# Altium schematic sheet lan_board.SchDoc
size A4
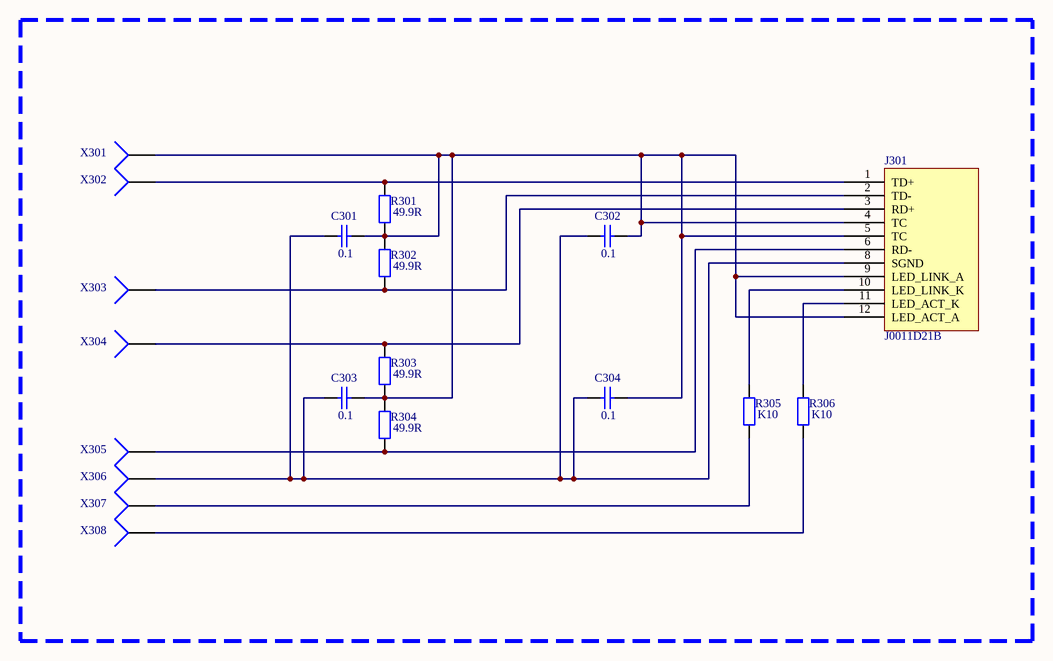
[diagram p0: lan_board.SchDoc]

## Parts
C301  0.1  [C3216-1206]
C302  0.1  [C3216-1206]
C303  0.1  [C3216-1206]
C304  0.1  [C3216-1206]
J301  J0011D21B  [J0011D21B]
R301  49.9R  [_1206]
R302  49.9R  [_1206]
R303  49.9R  [_1206]
R304  49.9R  [_1206]
R305  K10  [_1206]
R306  K10  [_1206]
X301  (no value)  [PIN1]
X302  (no value)  [PIN1]
X303  (no value)  [PIN1]
X304  (no value)  [PIN1]
X305  (no value)  [PIN1]
X306  (no value)  [PIN1]
X307  (no value)  [PIN1]
X308  (no value)  [PIN1]

## Nets
NetC301_1: C301.1 C302.1 C303.1 C304.1 J301.8(SGND) X306.1
NetC301_2: C301.2 C302.2 C303.2 C304.2 J301.4(TC) J301.5(TC) J301.9(LED_LINK_A) J301.12(LED_ACT_A) R301.2 R302.1 R303.2 R304.1 X301.1
NetJ301_1: J301.1(TD+) R301.1 X302.1
NetJ301_2: J301.2(TD-) R302.2 X303.1
NetJ301_3: J301.3(RD+) R303.1 X304.1
NetJ301_6: J301.6(RD-) R304.2 X305.1
NetJ301_10: J301.10(LED_LINK_K) R305.1
NetJ301_11: J301.11(LED_ACT_K) R306.1
NetR305_2: R305.2 X307.1
NetR306_2: R306.2 X308.1

## Library data of the parts
C301-C304 = Cap Semi: Capacitor (Semiconductor SIM Model); Manufacturer: Generic Components; Class I: Passive; Value: 1,0; Published: 8-Jun-2000; Revision: July-2002: Re-released for DXP Platform.; Publisher: Altium Limited; Class II: Capacitor
R301-R306 = Res2: Resistor; Manufacturer: Generic Components; Class I: Passive; Value: 30; Rule: Undefined; Published: 8-Jun-2000; Revision: July-2002: Re-released for DXP Platform.; Publisher: Altium Limited; Class II: Resistor
X301-X308 = Socket: Manufacturer: Generic Components; Class I: Connector; Revision: July-2002: Re-released for DXP Platform.; Publisher: Altium Limited